# Altium schematic sheet SRD-05VDC-SL-C.SchDoc
size A4
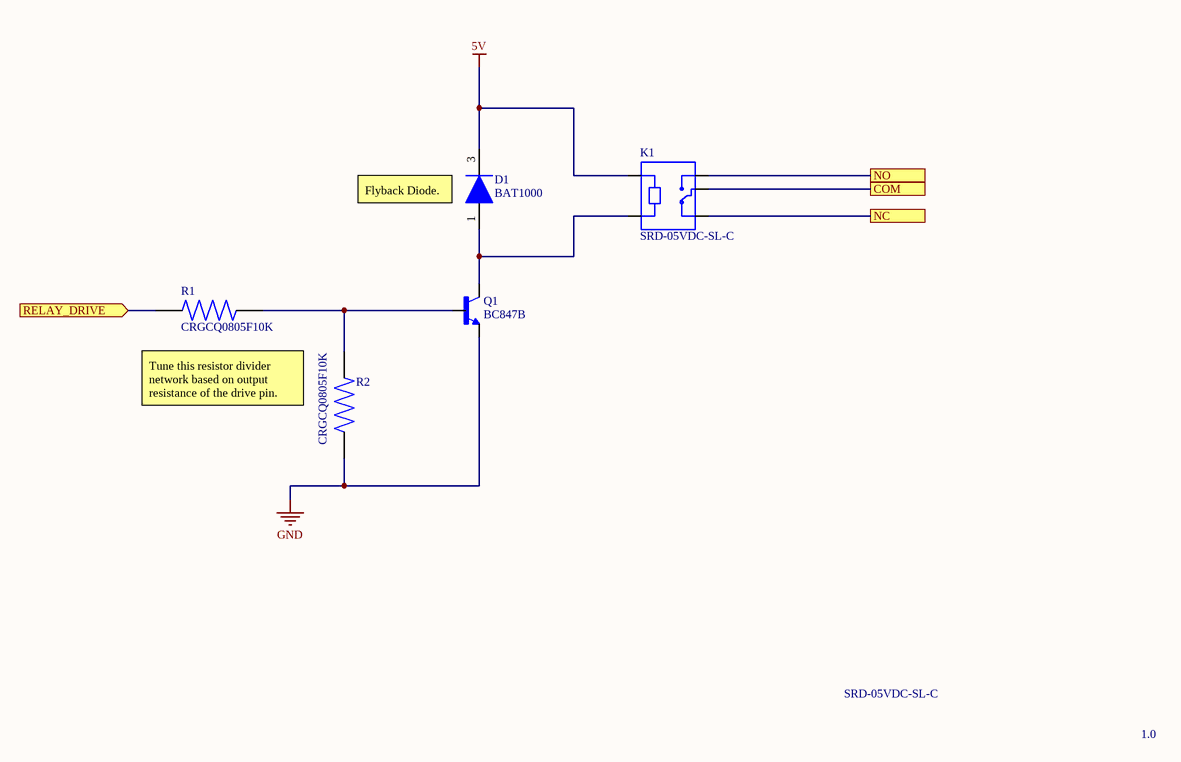
[diagram p0: SRD-05VDC-SL-C.SchDoc]

## Parts
D1  BAT1000  [SOT91P240X110-3N]
K1  SRD-05VDC-SL-C  [RELAY_SRD-05VDC-SL-C]
Q1  BC847B  [SOT100P230X110-3N]
R1  CRGCQ0805F10K  [RESC2012X65N]
R2  CRGCQ0805F10K  [RESC2012X65N]

## Ports
COM, NC, NO, RELAY_DRIVE (in)

## Nets
5V: D1.3(CATHODE) K1.A1
GND: Q1.2(E) R2.1
COM: K1.COM ; port COM
NC: K1.NC ; port NC
NO: K1.NO ; port NO
RELAY_DRIVE: R1.1 ; port RELAY_DRIVE
NetD1_1: D1.1(ANODE) K1.A2 Q1.3(C)
NetQ1_1: Q1.1(B) R1.2 R2.2

## Notes on the sheet
- (near D1) Flyback Diode.
- Tune this resistor divider network based on output resistance of the drive pin.
- SRD-05VDC-SL-C
- 1.0

## Library data of the parts
D1 = BAT1000: Diode Schottky 40V 1A Surface Mount SOT-23-3; MF: Diodes Inc.; Price: None; Package: SOT-23-3 Diodes Inc.; Value: *; MP: BAT1000; Availability: Unavailable; SnapEDA_Link: https://www.snapeda.com/parts/BAT1000/Diodes%20Inc./view-part/636578/?ref=snap
K1 = SRD-05VDC-SL-C: 5V Trigger Relay Module For Arduino And Raspberry Pi 5V Trigger Relay Module For Arduino And Raspberry Pi; MF: Songle Relay; Package: None; Availability: Unavailable; Value: *; MP: SRD-05VDC-SL-C; SnapEDA_Link: https://www.snapeda.com/parts/SRD-05VDC-SL-C/Songle%20Relay/view-part/1029484/?ref=snap; Price: None
Q1 = BC847B: Bipolar (BJT) Transistor NPN 45V 100mA 100MHz 150mW Surface Mount SOT-523; MF: STMicroelectronics; Availability: Unavailable; Package: SOT-23-3 NXP Semiconductors; Price: None; SnapEDA_Link: https://www.snapeda.com/parts/BC847B/STMicroelectronics/view-part/945669/?ref=snap; Value: *; MP: BC847B
R1 = CRGCQ0805F10K: Fixed Resistor CRGCQ 0805 10K 1%; MP: CRGCQ0805F2K2; MF: TE Connectivity; Availability: Unavailable; Package: 2012 TE Connectivity; Price: None; Value: *
R2 = CRGCQ0805F10K: Fixed Resistor CRGCQ 0805 10K 1%; MF: TE Connectivity; MP: CRGCQ0805F10K; DigiKey-Purchase-URL: https://snapeda.com/shop?store=DigiKey&id=3188209; Arrow_Electronics-Purchase-URL: https://snapeda.com/shop?store=Arrow+Electronics&id=3188209; Availability: Unavailable; SnapEDA_Link: https://www.snapeda.com/parts/CRGCQ0805F10K/TE%20Connectivity/view-part/3188209/?ref=snap; Package: 2012 TE Connectivity; Price: None; Value: *